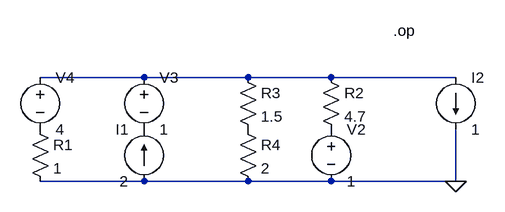
[diagram p0: schematic sourcemadness.asc]
sourcemadness.asc, the LTspice schematic file:
Version 4
SHEET 1 880 680
WIRE -64 240 -224 240
WIRE 96 240 -64 240
WIRE 224 240 96 240
WIRE 416 240 224 240
WIRE -64 400 -224 400
WIRE 96 400 -64 400
WIRE 224 400 96 400
WIRE 416 400 416 320
WIRE 416 400 224 400
FLAG 416 400 0
SYMBOL voltage -64 224 R0
SYMATTR InstName V3
SYMATTR Value 1
SYMBOL current -64 400 R180
WINDOW 0 24 80 Left 2
WINDOW 3 24 0 Left 2
SYMATTR InstName I1
SYMATTR Value 2
SYMBOL voltage -224 224 R0
SYMATTR InstName V4
SYMATTR Value 4
SYMBOL res -240 304 R0
SYMATTR InstName R1
SYMATTR Value 1
SYMBOL current 416 240 R0
SYMATTR InstName I2
SYMATTR Value 1
SYMBOL voltage 224 304 R0
SYMATTR InstName V2
SYMATTR Value 1
SYMBOL res 208 224 R0
SYMATTR InstName R2
SYMATTR Value 4.7
SYMBOL res 80 224 R0
SYMATTR InstName R3
SYMATTR Value 1.5
SYMBOL res 80 304 R0
SYMATTR InstName R4
SYMATTR Value 2
TEXT 320 168 Left 2 !.op

The netlist it stands for:
* sourcemadness.asc
V3 N001 P001 1
I1 0 P001 2
V4 N001 P002 4
R1 P002 0 1
I2 N001 0 1
V2 P003 0 1
R2 N001 P003 4.7
R3 N001 P004 1.5
R4 P004 0 2
.op
.backanno
.end